# Altium project Placa_Módulo.PrjPcb
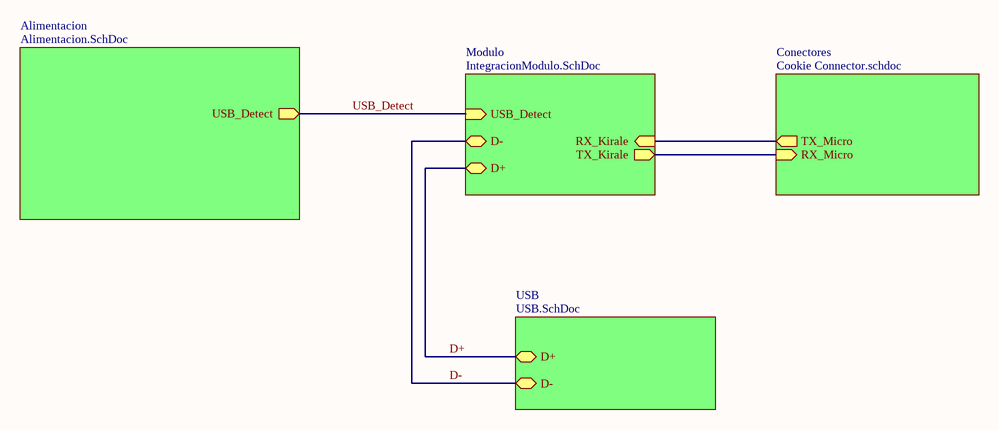
[diagram p0: TOP.SchDoc]
5 sheets, 23 parts. Net scope: hierarchical (ports join the sheet entries above them; power ports are global).
Board file: Modulo_THREAD.pcbdoc
Sheets:
  TOP.SchDoc
    Modulo = IntegracionModulo.SchDoc
    Conectores = Cookie Connector.schdoc
    USB = USB.SchDoc
    Alimentacion = Alimentacion.SchDoc

## Sheet TOP.SchDoc
size A4

### Sub-sheets
Alimentacion = Alimentacion.SchDoc: USB_Detect (out)
Conectores = Cookie Connector.schdoc: RX_Micro (in), TX_Micro (out)
Modulo = IntegracionModulo.SchDoc: RX_Kirale (in), TX_Kirale (out), USB_Detect (in), D+ (bidir), D- (bidir)
USB = USB.SchDoc: D- (bidir), D+ (bidir)

### Nets
D+: sheet Modulo/D+, sheet USB/D+
D-: sheet Modulo/D-, sheet USB/D-
I40: sheet Modulo/RX_Kirale, sheet Conectores/TX_Micro
I41: sheet Modulo/TX_Kirale, sheet Conectores/RX_Micro
USB_Detect: sheet Modulo/USB_Detect, sheet Alimentacion/USB_Detect

## Sheet IntegracionModulo.SchDoc
size A4
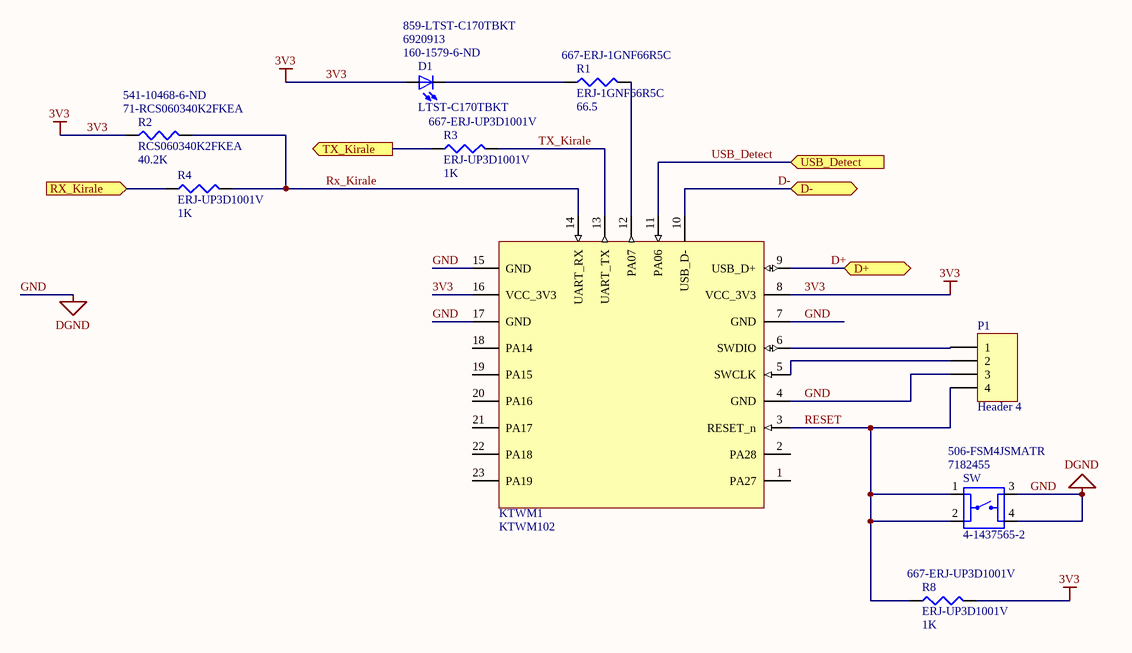
[diagram p1: IntegracionModulo.SchDoc]

### Parts
D1  LTST-C170TBKT  Supplier Part Number 1: 160-1579-6-ND  Supplier Part Number 2: 6920913  Supplier Part Number 3: 859-LTST-C170TBKT  [DIOC200X125X110]
KTWM1  KTWM102  [KTWM102]
P1  Header 4  [HDR1X4]
R1  ERJ-1GNF66R5C  value 66.5  Supplier Part Number 1: 667-ERJ-1GNF66R5C  [J1-0603]
R2  RCS060340K2FKEA  value 40.2K  Supplier Part Number 1: 71-RCS060340K2FKEA  Supplier Part Number 2: 541-10468-6-ND  [J1-0603]
R3  ERJ-UP3D1001V  value 1K  Supplier Part Number 1: 667-ERJ-UP3D1001V  [J1-0603]
R4  ERJ-UP3D1001V  value 1K  [J1-0603]
R8  ERJ-UP3D1001V  value 1K  Supplier Part Number 1: 667-ERJ-UP3D1001V  [J1-0603]
SW  4-1437565-2  Supplier Part Number 1: 7182455  Supplier Part Number 2: 506-FSM4JSMATR  [SW_4-1437565-2]

### Ports
D+ (bidir), D- (bidir), RX_Kirale (in), TX_Kirale (out), USB_Detect (in)

### Nets
3V3: D1.POS KTWM1.8(VCC_3V3) KTWM1.16(VCC_3V3) R2.1 R8.2
DGND: KTWM1.4(GND) KTWM1.7(GND) KTWM1.15(GND) KTWM1.17(GND) P1.3 SW.3 SW.4  [also labelled GND]
D+: KTWM1.9(USB_D+) ; port D+
D-: KTWM1.10(USB_D-) ; port D-
I40: R4.1 ; port RX_Kirale
I41: R3.1 ; port TX_Kirale
RESET: KTWM1.3(RESET_n) P1.4 R8.1 SW.1 SW.2
Rx_Kirale: KTWM1.14(UART_RX) R2.2 R4.2
TX_Kirale: KTWM1.13(UART_TX) R3.2
USB_Detect: KTWM1.11(PA06) ; port USB_Detect
NetD1_NEG: D1.NEG R1.1
NetKTWM1_5: KTWM1.5(SWCLK) P1.2
NetKTWM1_6: KTWM1.6(SWDIO) P1.1
NetKTWM1_12: KTWM1.12(PA07) R1.2

Not connected (* = marked no-connect by the designer): KTWM1 1(PA27) 2(PA28) 18(PA14) 19(PA15) 20(PA16) 21(PA17) 22(PA18) 23(PA19)

### Library data of the parts
D1 = LTST-C170TBKT: Blue 470nm LED Indication - Discrete 3.3V 0805 _2012 Metric_; MF: Lite-On Inc.; SnapEDA_Link: https://www.snapeda.com/parts/LTST-C170TBKT/Lite-On%20Inc./view-part/217848/?ref=snap; MP: LTST-C170TBKT; Value: *; Digi-Key_Part_Number: 160-1579-1-ND; Digi-Key_Purchase_URL: https://www.digikey.jp/product-detail/en/lite-on-inc/LTST-C170TBKT/160-1579-1-ND/564889?utm_source=snapeda&utm_medium=aggregator&utm_campaign=symbol; Package: 0805 Lite-On; Supplier 1: Digi-Key; Supplier 2: RSComponents; Supplier 3: Mouser
KTWM1 = KTWM102: https://www.kirale.com/products/ktwm102/
P1 = Header 4: Header, 4-Pin; LatestRevisionDate: 17-Jul-2002; LatestRevisionNote: Re-released for DXP Platform.; Publisher: Altium Limited
R1-R4 R8 = Res3: Resistor; Published: 8-Jun-2000; LatestRevisionDate: 29-May-2009; LatestRevisionNote: IPC-7351 Footprint Added.; PackageReference: J1-0603; Publisher: Altium Limited; PackageDescription: Chip Resistor; Supplier 1: Mouser
  R2: Supplier 2: Digi-Key
SW = 4-1437565-2: Switch Tactile OFF _ON_ SPST Round Button Gull Wing 0.05A 24VDC 1VA 9.18N SMD T/R; MF: TE Connectivity; MP: FSM4JSMATR; Package: None; Price: None; TE_purchase_URL: https://www.te.com/usa-en/product-4-1437565-2.html?te_bu=Cor&te_type=disp&te_campaign=seda_glo_cor-seda-global-disp-prtnr-fy19-seda-model-bom-cta_sma-317_1&elqCampaignId=32493; SnapEDA_Link: https://www.snapeda.com/parts/FSM4JSMATR/TE%20Connectivity%20ALCOSWITCH%20Switches/view-part/2774279/?ref=snap; Availability: Unavailable; Value: *; Supplier 1: RSComponents; Supplier 2: Mouser

## Sheet Cookie Connector.schdoc
size A4
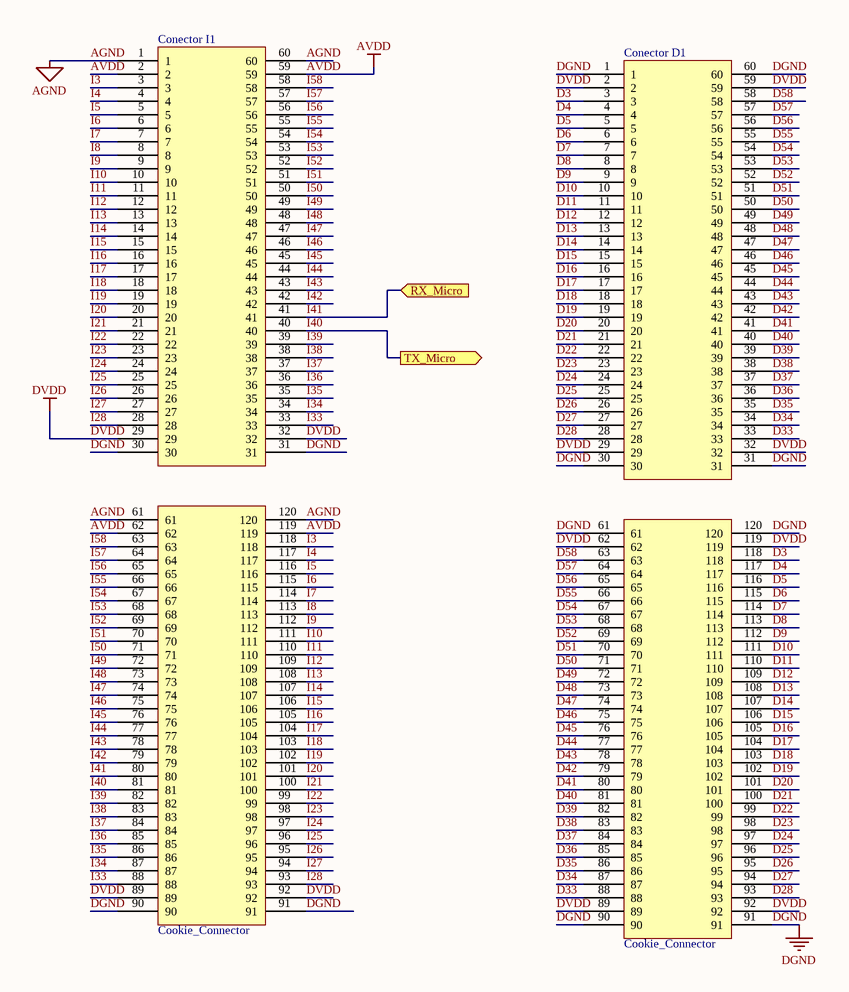
[diagram p2: Cookie Connector.schdoc]

### Parts
Conector_D1  Cookie_Connector  [COOKIECON_HEADER_AND_SOCKET]
Conector_I1  Cookie_Connector  [COOKIECON_HEADER_AND_SOCKET]

### Ports
RX_Micro (in), TX_Micro (out)

### Nets
AGND: Conector_I1.1 Conector_I1.60 Conector_I1.61 Conector_I1.120
AVDD: Conector_I1.2 Conector_I1.59 Conector_I1.62 Conector_I1.119
DGND: Conector_D1.1 Conector_D1.30 Conector_D1.31 Conector_D1.60 Conector_D1.61 Conector_D1.90 Conector_D1.91 Conector_D1.120 Conector_I1.30 Conector_I1.31 Conector_I1.90 Conector_I1.91
DVDD: Conector_D1.2 Conector_D1.29 Conector_D1.32 Conector_D1.59 Conector_D1.62 Conector_D1.89 Conector_D1.92 Conector_D1.119 Conector_I1.29 Conector_I1.32 Conector_I1.89 Conector_I1.92
D3: Conector_D1.3 Conector_D1.118
D4: Conector_D1.4 Conector_D1.117
D5: Conector_D1.5 Conector_D1.116
D6: Conector_D1.6 Conector_D1.115
D7: Conector_D1.7 Conector_D1.114
D8: Conector_D1.8 Conector_D1.113
D9: Conector_D1.9 Conector_D1.112
D10: Conector_D1.10 Conector_D1.111
D11: Conector_D1.11 Conector_D1.110
D12: Conector_D1.12 Conector_D1.109
D13: Conector_D1.13 Conector_D1.108
D14: Conector_D1.14 Conector_D1.107
D15: Conector_D1.15 Conector_D1.106
D16: Conector_D1.16 Conector_D1.105
D17: Conector_D1.17 Conector_D1.104
D18: Conector_D1.18 Conector_D1.103
D19: Conector_D1.19 Conector_D1.102
D20: Conector_D1.20 Conector_D1.101
D21: Conector_D1.21 Conector_D1.100
D22: Conector_D1.22 Conector_D1.99
D23: Conector_D1.23 Conector_D1.98
D24: Conector_D1.24 Conector_D1.97
D25: Conector_D1.25 Conector_D1.96
D26: Conector_D1.26 Conector_D1.95
D27: Conector_D1.27 Conector_D1.94
D28: Conector_D1.28 Conector_D1.93
D33: Conector_D1.33 Conector_D1.88
D34: Conector_D1.34 Conector_D1.87
D35: Conector_D1.35 Conector_D1.86
D36: Conector_D1.36 Conector_D1.85
D37: Conector_D1.37 Conector_D1.84
D38: Conector_D1.38 Conector_D1.83
D39: Conector_D1.39 Conector_D1.82
D40: Conector_D1.40 Conector_D1.81
D41: Conector_D1.41 Conector_D1.80
D42: Conector_D1.42 Conector_D1.79
D43: Conector_D1.43 Conector_D1.78
D44: Conector_D1.44 Conector_D1.77
D45: Conector_D1.45 Conector_D1.76
D46: Conector_D1.46 Conector_D1.75
D47: Conector_D1.47 Conector_D1.74
D48: Conector_D1.48 Conector_D1.73
D49: Conector_D1.49 Conector_D1.72
D50: Conector_D1.50 Conector_D1.71
D51: Conector_D1.51 Conector_D1.70
D52: Conector_D1.52 Conector_D1.69
D53: Conector_D1.53 Conector_D1.68
D54: Conector_D1.54 Conector_D1.67
D55: Conector_D1.55 Conector_D1.66
D56: Conector_D1.56 Conector_D1.65
D57: Conector_D1.57 Conector_D1.64
D58: Conector_D1.58 Conector_D1.63
I3: Conector_I1.3 Conector_I1.118
I4: Conector_I1.4 Conector_I1.117
I5: Conector_I1.5 Conector_I1.116
I6: Conector_I1.6 Conector_I1.115
I7: Conector_I1.7 Conector_I1.114
I8: Conector_I1.8 Conector_I1.113
I9: Conector_I1.9 Conector_I1.112
I10: Conector_I1.10 Conector_I1.111
I11: Conector_I1.11 Conector_I1.110
I12: Conector_I1.12 Conector_I1.109
I13: Conector_I1.13 Conector_I1.108
I14: Conector_I1.14 Conector_I1.107
I15: Conector_I1.15 Conector_I1.106
I16: Conector_I1.16 Conector_I1.105
I17: Conector_I1.17 Conector_I1.104
I18: Conector_I1.18 Conector_I1.103
I19: Conector_I1.19 Conector_I1.102
I20: Conector_I1.20 Conector_I1.101
I21: Conector_I1.21 Conector_I1.100
I22: Conector_I1.22 Conector_I1.99
I23: Conector_I1.23 Conector_I1.98
I24: Conector_I1.24 Conector_I1.97
I25: Conector_I1.25 Conector_I1.96
I26: Conector_I1.26 Conector_I1.95
I27: Conector_I1.27 Conector_I1.94
I28: Conector_I1.28 Conector_I1.93
I33: Conector_I1.33 Conector_I1.88
I34: Conector_I1.34 Conector_I1.87
I35: Conector_I1.35 Conector_I1.86
I36: Conector_I1.36 Conector_I1.85
I37: Conector_I1.37 Conector_I1.84
I38: Conector_I1.38 Conector_I1.83
I39: Conector_I1.39 Conector_I1.82
I40: Conector_I1.40 Conector_I1.81 ; port TX_Micro
I41: Conector_I1.41 Conector_I1.80 ; port RX_Micro
I42: Conector_I1.42 Conector_I1.79
I43: Conector_I1.43 Conector_I1.78
I44: Conector_I1.44 Conector_I1.77
I45: Conector_I1.45 Conector_I1.76
I46: Conector_I1.46 Conector_I1.75
I47: Conector_I1.47 Conector_I1.74
I48: Conector_I1.48 Conector_I1.73
I49: Conector_I1.49 Conector_I1.72
I50: Conector_I1.50 Conector_I1.71
I51: Conector_I1.51 Conector_I1.70
I52: Conector_I1.52 Conector_I1.69
I53: Conector_I1.53 Conector_I1.68
I54: Conector_I1.54 Conector_I1.67
I55: Conector_I1.55 Conector_I1.66
I56: Conector_I1.56 Conector_I1.65
I57: Conector_I1.57 Conector_I1.64
I58: Conector_I1.58 Conector_I1.63

## Sheet USB.SchDoc
size A4
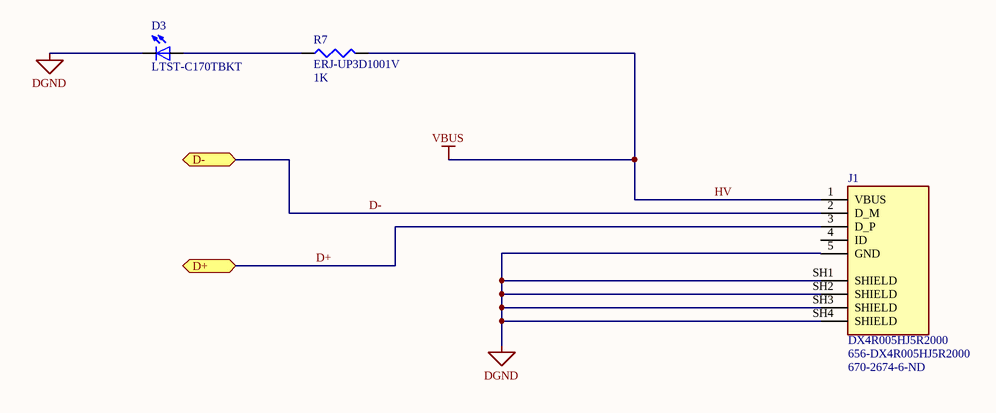
[diagram p3: USB.SchDoc]

### Parts
D3  LTST-C170TBKT  [DIOC200X125X110]
J1  DX4R005HJ5R2000  Supplier Part Number 1: 656-DX4R005HJ5R2000  Supplier Part Number 2: 670-2674-6-ND  [JAE_DX4R005HJ5R2000]
R7  ERJ-UP3D1001V  value 1K  [J1-0603]

### Ports
D+ (bidir), D- (bidir)

### Nets
DGND: D3.NEG J1.5(GND) J1.SH1(SHIELD) J1.SH2(SHIELD) J1.SH3(SHIELD) J1.SH4(SHIELD)
HV: J1.1(VBUS) R7.2  [also labelled VBUS]
D+: J1.3(D_P) ; port D+
D-: J1.2(D_M) ; port D-
NetD3_POS: D3.POS R7.1

Not connected (* = marked no-connect by the designer): J1 4(ID)

### Library data of the parts
D3 = LTST-C170TBKT: as D1 on sheet IntegracionModulo; SnapEDA_Link: https://www.snapeda.com/parts/LTST-C170TBKT/Lite-On%20Inc./view-part/217848/?ref=snap; MP: LTST-C170TBKT; Value: *; Digi-Key_Part_Number: 160-1579-1-ND; Digi-Key_Purchase_URL: https://www.digikey.jp/product-detail/en/lite-on-inc/LTST-C170TBKT/160-1579-1-ND/564889?utm_source=snapeda&utm_medium=aggregator&utm_campaign=symbol; Package: 0805 Lite-On; Supplier 1: Digi-Key; Supplier Part Number 1: 160-1579-1-ND; Supplier 2: RSComponents; Supplier Part Number 2: 6920913; Supplier 3: Mouser; Supplier Part Number 3: 859-LTST-C170TBKT
J1 = DX4R005HJ5R2000: USB - micro B USB 2.0 Receptacle Connector 5 Position Surface Mount, Right Angle; MF: JAE Electronics; Value: *; Price: None; Package: None; SnapEDA_Link: https://www.snapeda.com/parts/DX4R005HJ5R2000/JAE%20Electronics/view-part/554854/?ref=snap; Availability: Unavailable; MP: DX4R005HJ5R2000; Supplier 1: Mouser; Supplier 2: Digi-Key
R7 = Res3: Resistor; Published: 8-Jun-2000; LatestRevisionDate: 29-May-2009; LatestRevisionNote: IPC-7351 Footprint Added.; PackageReference: J1-0603; Publisher: Altium Limited; PackageDescription: Chip Resistor; Supplier 1: Mouser; Supplier Part Number 1: 667-ERJ-UP3D1001V

## Sheet Alimentacion.SchDoc
size A4
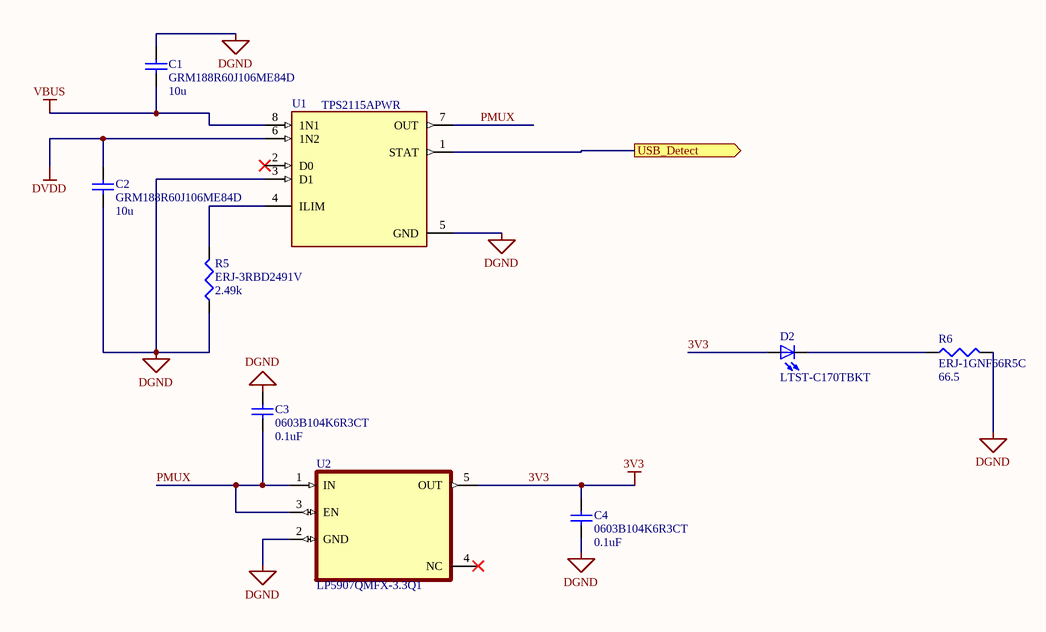
[diagram p4: Alimentacion.SchDoc]

### Parts
C1  GRM188R60J106ME84D  value 10u  [1608[0603]]
C2  GRM188R60J106ME84D  value 10u  [1608[0603]]
C3  0603B104K6R3CT  value 0.1uF  [1608[0603]]
C4  0603B104K6R3CT  value 0.1uF  [1608[0603]]
D2  LTST-C170TBKT  [DIOC200X125X110]
R5  ERJ-3RBD2491V  value 2.49k  [J1-0603]
R6  ERJ-1GNF66R5C  value 66.5  [J1-0603]
U1  TPS2115APWR  [SOP65P640X120-8N]
U2  LP5907QMFX-3.3Q1  [SOT95P280X145-5N]

### Ports
USB_Detect (out)

### Nets
3V3: C4.2 D2.POS U2.5(OUT)
DGND: C1.2 C2.1 C3.2 C4.1 R5.1 R6.2 U1.3(D1) U1.5(GND) U2.2(GND)
DVDD: C2.2 U1.6(1N2)
VBUS: C1.1 U1.8(1N1)  [project net HV]
PMUX: C3.1 U1.7(OUT) U2.1(IN) U2.3(EN)
USB_Detect: U1.1(STAT) ; port USB_Detect
NetD2_NEG: D2.NEG R6.1
NetR5_2: R5.2 U1.4(ILIM)

Not connected (* = marked no-connect by the designer): U1 2(D0)*; U2 4(NC)*

### Library data of the parts
C1-C4 = Cap Semi: Capacitor (Semiconductor SIM Model); Published: 8-Jun-2000; LatestRevisionDate: 29-May-2009; LatestRevisionNote: IPC-7351 Footprint Added.; PackageReference: C1206; Publisher: Altium Limited; PackageDescription: Chip Capacitor; Supplier 1: Mouser
  C1 C2: Supplier Part Number 1: 81-GRM188R60J106ME4D; Supplier 2: Digi-Key; Supplier Part Number 2: 490-7316-6-ND
  C3 C4: Supplier Part Number 1: 791-0603B104K6R3CT
D2 = LTST-C170TBKT: as D1 on sheet IntegracionModulo; SnapEDA_Link: https://www.snapeda.com/parts/LTST-C170TBKT/Lite-On%20Inc./view-part/217848/?ref=snap; MP: LTST-C170TBKT; Value: *; Digi-Key_Part_Number: 160-1579-1-ND; Digi-Key_Purchase_URL: https://www.digikey.jp/product-detail/en/lite-on-inc/LTST-C170TBKT/160-1579-1-ND/564889?utm_source=snapeda&utm_medium=aggregator&utm_campaign=symbol; Package: 0805 Lite-On; Supplier 1: Digi-Key; Supplier Part Number 1: 160-1579-6-ND; Supplier 2: RSComponents; Supplier Part Number 2: 6920913; Supplier 3: Mouser; Supplier Part Number 3: 859-LTST-C170TBKT
R5 R6 = Res3: Resistor; Published: 8-Jun-2000; LatestRevisionDate: 29-May-2009; LatestRevisionNote: IPC-7351 Footprint Added.; PackageReference: J1-0603; Publisher: Altium Limited; PackageDescription: Chip Resistor; Supplier 1: Mouser
  R5: Supplier Part Number 1: 667-ERJ-3RBD2491V
  R6: Supplier Part Number 1: 667-ERJ-1GNF66R5C
U1 = TPS2115APWR: 2.8-5.5-V, 84-m?, 1.25-A, power mux with manual, automatic switchover and status output 8-TSSOP -40 to 85; Package: None; Availability: Unavailable; Price: None; Value: *; MP: TPS2115APWR; Supplier 1: Mouser; Supplier Part Number 1: 595-TPS2115APWR; Supplier 2: Digi-Key; Supplier Part Number 2: 296-16940-6-ND
U2 = LP5907QMFX-3.3Q1: Automotive 250-mA, low-noise, high-PSRR, low-IQ, ultra-low-dropout voltage regulator with low-IQ 5-SOT-23 -40 to 125; MF: Texas Instruments; Purchase-URL: https://pricing.snapeda.com/search/part/LP5907QMFX-3.3Q1/?ref=eda; Availability: Good; SnapEDA_Link: https://www.snapeda.com/parts/LP5907QMFX-3.3Q1/Texas%20Instruments/view-part/559786/?ref=snap; Price: None; Package: SOT-23-5 Texas Instruments; Check_prices: https://www.snapeda.com/parts/LP5907QMFX-3.3Q1/Texas%20Instruments/view-part/559786/?ref=eda; Value: *; MP: LP5907QMFX-3.3Q1; Supplier 1: Mouser; Supplier Part Number 1: 595-LP5907QMFX-3.3Q1

## Nets that join several sheets
3V3: IntegracionModulo (5 pins), Alimentacion (C4.2 D2.POS U2.5)
DGND: IntegracionModulo (7 pins), Cookie Connector (12 pins), USB (6 pins), Alimentacion (9 pins)
DVDD: Cookie Connector (12 pins), Alimentacion (C2.2 U1.6)
HV: USB (J1.1 R7.2), Alimentacion (C1.1 U1.8)
D+: IntegracionModulo (KTWM1.9), USB (J1.3)
D-: IntegracionModulo (KTWM1.10), USB (J1.2)
I40: IntegracionModulo (R4.1), Cookie Connector (Conector_I1.40 Conector_I1.81)
I41: IntegracionModulo (R3.1), Cookie Connector (Conector_I1.41 Conector_I1.80)
USB_Detect: IntegracionModulo (KTWM1.11), Alimentacion (U1.1)